# Altium project buck.PrjPcb
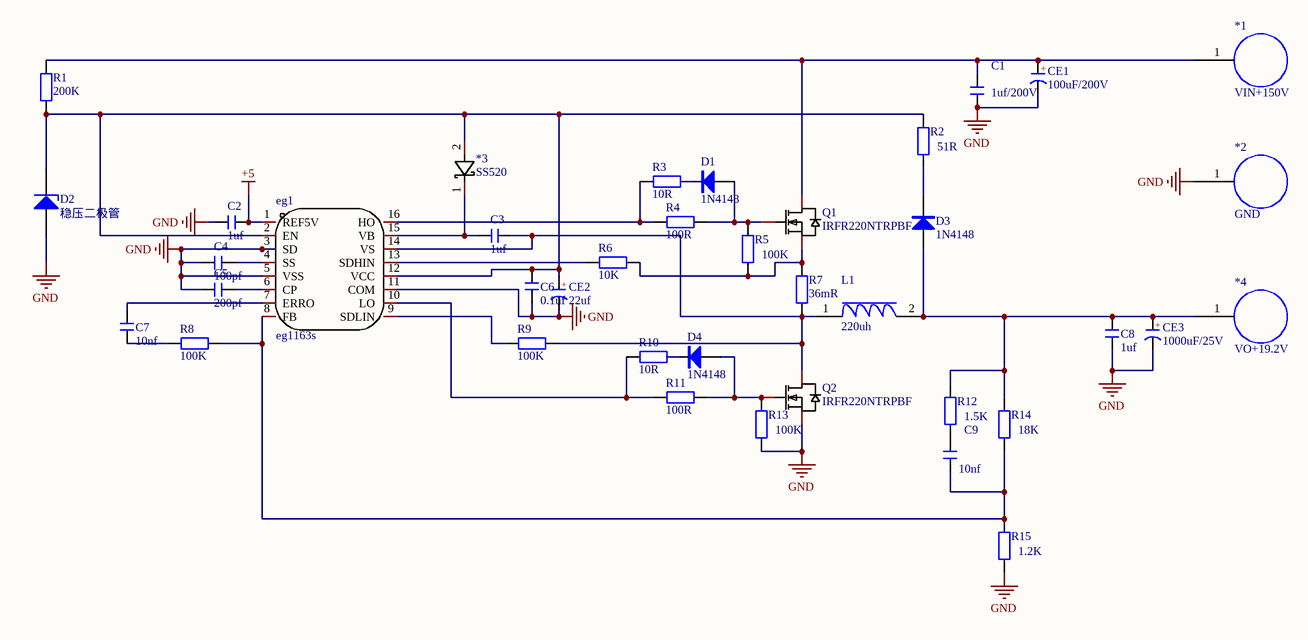
[diagram p0: buck.SchDoc]
1 sheet, 39 parts. Net scope: global (net labels, ports and power ports of the same name join across sheets).
Board file: buck.PcbDoc

## Sheet buck.SchDoc
size A4

### Parts
*1  VIN+150V  [焊盘接口]
*2  GND  [焊盘接口]
*3  SS520  [SS520]
*4  VO+19.2V  [焊盘接口]
C1  1uf/200V  [C 0603_L]
C2  1uf  [C 0603_L]
C3  1uf  [C 0603_L]
C4  100pf  [C 0603_L]
C5  200pf  [C 0603_L]
C6  0.1uf  [C 0603_L]
C7  10nf  [C 0603_L]
C8  1uf  [C 0603_L]
C9  10nf  [C 0603_L]
CE1  100uF/200V  [CAP 10*22*40 - GD]
CE2  22uf  [CAP 10*22*31.5]
CE3  1000uF/25V  [CAP 10*22*31.5]
D1  1N4148  [MINI_MELF (LL34)]
D2  稳压二极管  [SOD-123]
D3  1N4148  [MINI_MELF (LL34)]
D4  1N4148  [MINI_MELF (LL34)]
eg1  eg1163s  [eg1163S]
L1  220uh  [电感]
Q1  IRFR220NTRPBF  [IRFR220NTRPBF]
Q2  IRFR220NTRPBF  [IRFR220NTRPBF]
R1  200K  [RES 0603]
R2  51R  [RES 0603]
R3  10R  [RES 0603]
R4  100R  [RES 0603]
R5  100K  [RES 0603]
R6  10K  [RES 0603]
R7  36mR  [RES 0603]
R8  100K  [RES 0603]
R9  100K  [RES 0603]
R10  10R  [RES 0603]
R11  100R  [RES 0603]
R12  1.5K  [RES 0603]
R13  100K  [RES 0603]
R14  18K  [RES 0603]
R15  1.2K  [RES 0603]

### Nets
+5: C2.2 eg1.1(REF5V)
GND: *2.1 C1.1 C2.1 C4.1 C5.1 C6.2 C8.1 CE1.2(K) CE2.2(K) CE3.2(K) D2.1(A) eg1.3(SD) eg1.5(VSS) eg1.11(COM) Q2.3(S) R13.2 R15.2
Net*1_1: *1.1 C1.2 CE1.1(A) Q1.2(D) R1.2
Net*3_1: *3.1(K) C3.2 eg1.15(VB)
Net*3_2: *3.2(A) C6.1 CE2.1(A) D2.2(K) eg1.2(EN) eg1.12(VCC) R1.1 R2.1
Net*4_1: *4.1 C8.2 CE3.1(A) D3.1(A) L1.2 R12.1 R14.1
NetC3_1: C3.1 eg1.14(VS) L1.1 Q2.2(D) R7.2 R9.1
NetC4_2: C4.2 eg1.4(SS)
NetC5_2: C5.2 eg1.6(CP)
NetC7_1: C7.1 R8.2
NetC7_2: C7.2 eg1.7(ERRO)
NetC9_1: C9.1 eg1.8(FB) R8.1 R14.2 R15.1
NetC9_2: C9.2 R12.2
NetD1_1: D1.1(A) Q1.1(G) R4.1 R5.1
NetD1_2: D1.2(K) R3.1
NetD3_2: D3.2(K) R2.2
NetD4_1: D4.1(A) Q2.1(G) R11.1 R13.1
NetD4_2: D4.2(K) R10.1
Neteg1_9: eg1.9(SDLIN) R9.2
Neteg1_10: eg1.10(LO) R10.2 R11.2
Neteg1_13: eg1.13(SDHIN) R6.2
Neteg1_16: eg1.16(HO) R3.2 R4.2
NetQ1_3: Q1.3(S) R5.2 R6.1 R7.1

### Notes on the sheet
- (in symbol CE) +

### Library data of the parts
*1 *2 *4 = 焊盘接口
C1-C9 = C: 贴片电容; BOM名称: 无极性贴片电容; 淘宝ID: 封装库来自淘宝 ID：黄晶宝石; 联系售后，技术支持: https://shop463601444.taobao.com; 唯一出售店铺网址: https://shop463601444.taobao.com
CE1-CE3 = CE: 直插电解电容; 淘宝ID: 封装库来自淘宝 ID：黄晶宝石; BOM名称: 直插电解电容; 联系售后: https://shop463601444.taobao.com
D1 D3 D4 = 1N4148: 开关二极管; BOM名称: 高速开关二极管; 淘宝ID: 封装库来自淘宝 ID：黄晶宝石; 欢迎光临: https://shop463601444.taobao.com
D2 = 稳压二极管: Zener Diode; 封装库来自淘宝卖家 ID：黄晶宝石: 其他店铺购入均为盗版，不享受售后技术支持服务，请立即申请退款
L1 = 电感
Q1 Q2 = IRFR220NTRPBF: Manufacturer: Infineon(英飞凌); Add into BOM: yes; Type: 1个N沟道; Drain Source Voltage (Vdss): 200V; Continuous Drain Current (Id): 5A; Power Dissipation (Pd): 43W; Drain Source On Resistance (RDS(on)@Vgs,Id): 600mΩ@10V,2.9A; Gate Threshold Voltage (Vgs(th)@Id): 4V@250uA; Total Gate Charge (Qg@Vgs): 23nC@10V; Input Capacitance (Ciss@Vds): 300pF@25V; Symbol: IRFR220N; Device: IRFR220NTRPBF; LCSC Part Name: 1个N沟道 耐压:200V 电流:5A; Supplier Part: C2584; Manufacturer Part: IRFR220NTRPBF; Supplier Footprint: TO-252-2(DPAK); Datasheet: https://atta.szlcsc.com/upload/public/pdf/source/20200323/C500528_AD38F318A115118F4DB56F5A4EA6919E.pdf; Supplier: LCSC; Convert to PCB: yes; Operating Temperature: -55℃~+175℃@(Tj); Name: IRFR220NTRPBF
R1-R15 = R: 贴片电阻; 版权归属: 来自淘宝 ID：黄晶宝石; 封装库来自淘宝卖家 ID：黄晶宝石: 其他店铺购入均为盗版，不享受售后技术支持服务，请立即申请退款; BOM名称: 贴片电阻; 联系售后: https://shop463601444.taobao.com